# EasyEDA Pro project ProProject_2.4G Wireless_2024-12-04.epro, board PCB_2.4g 无线遥控板 copy
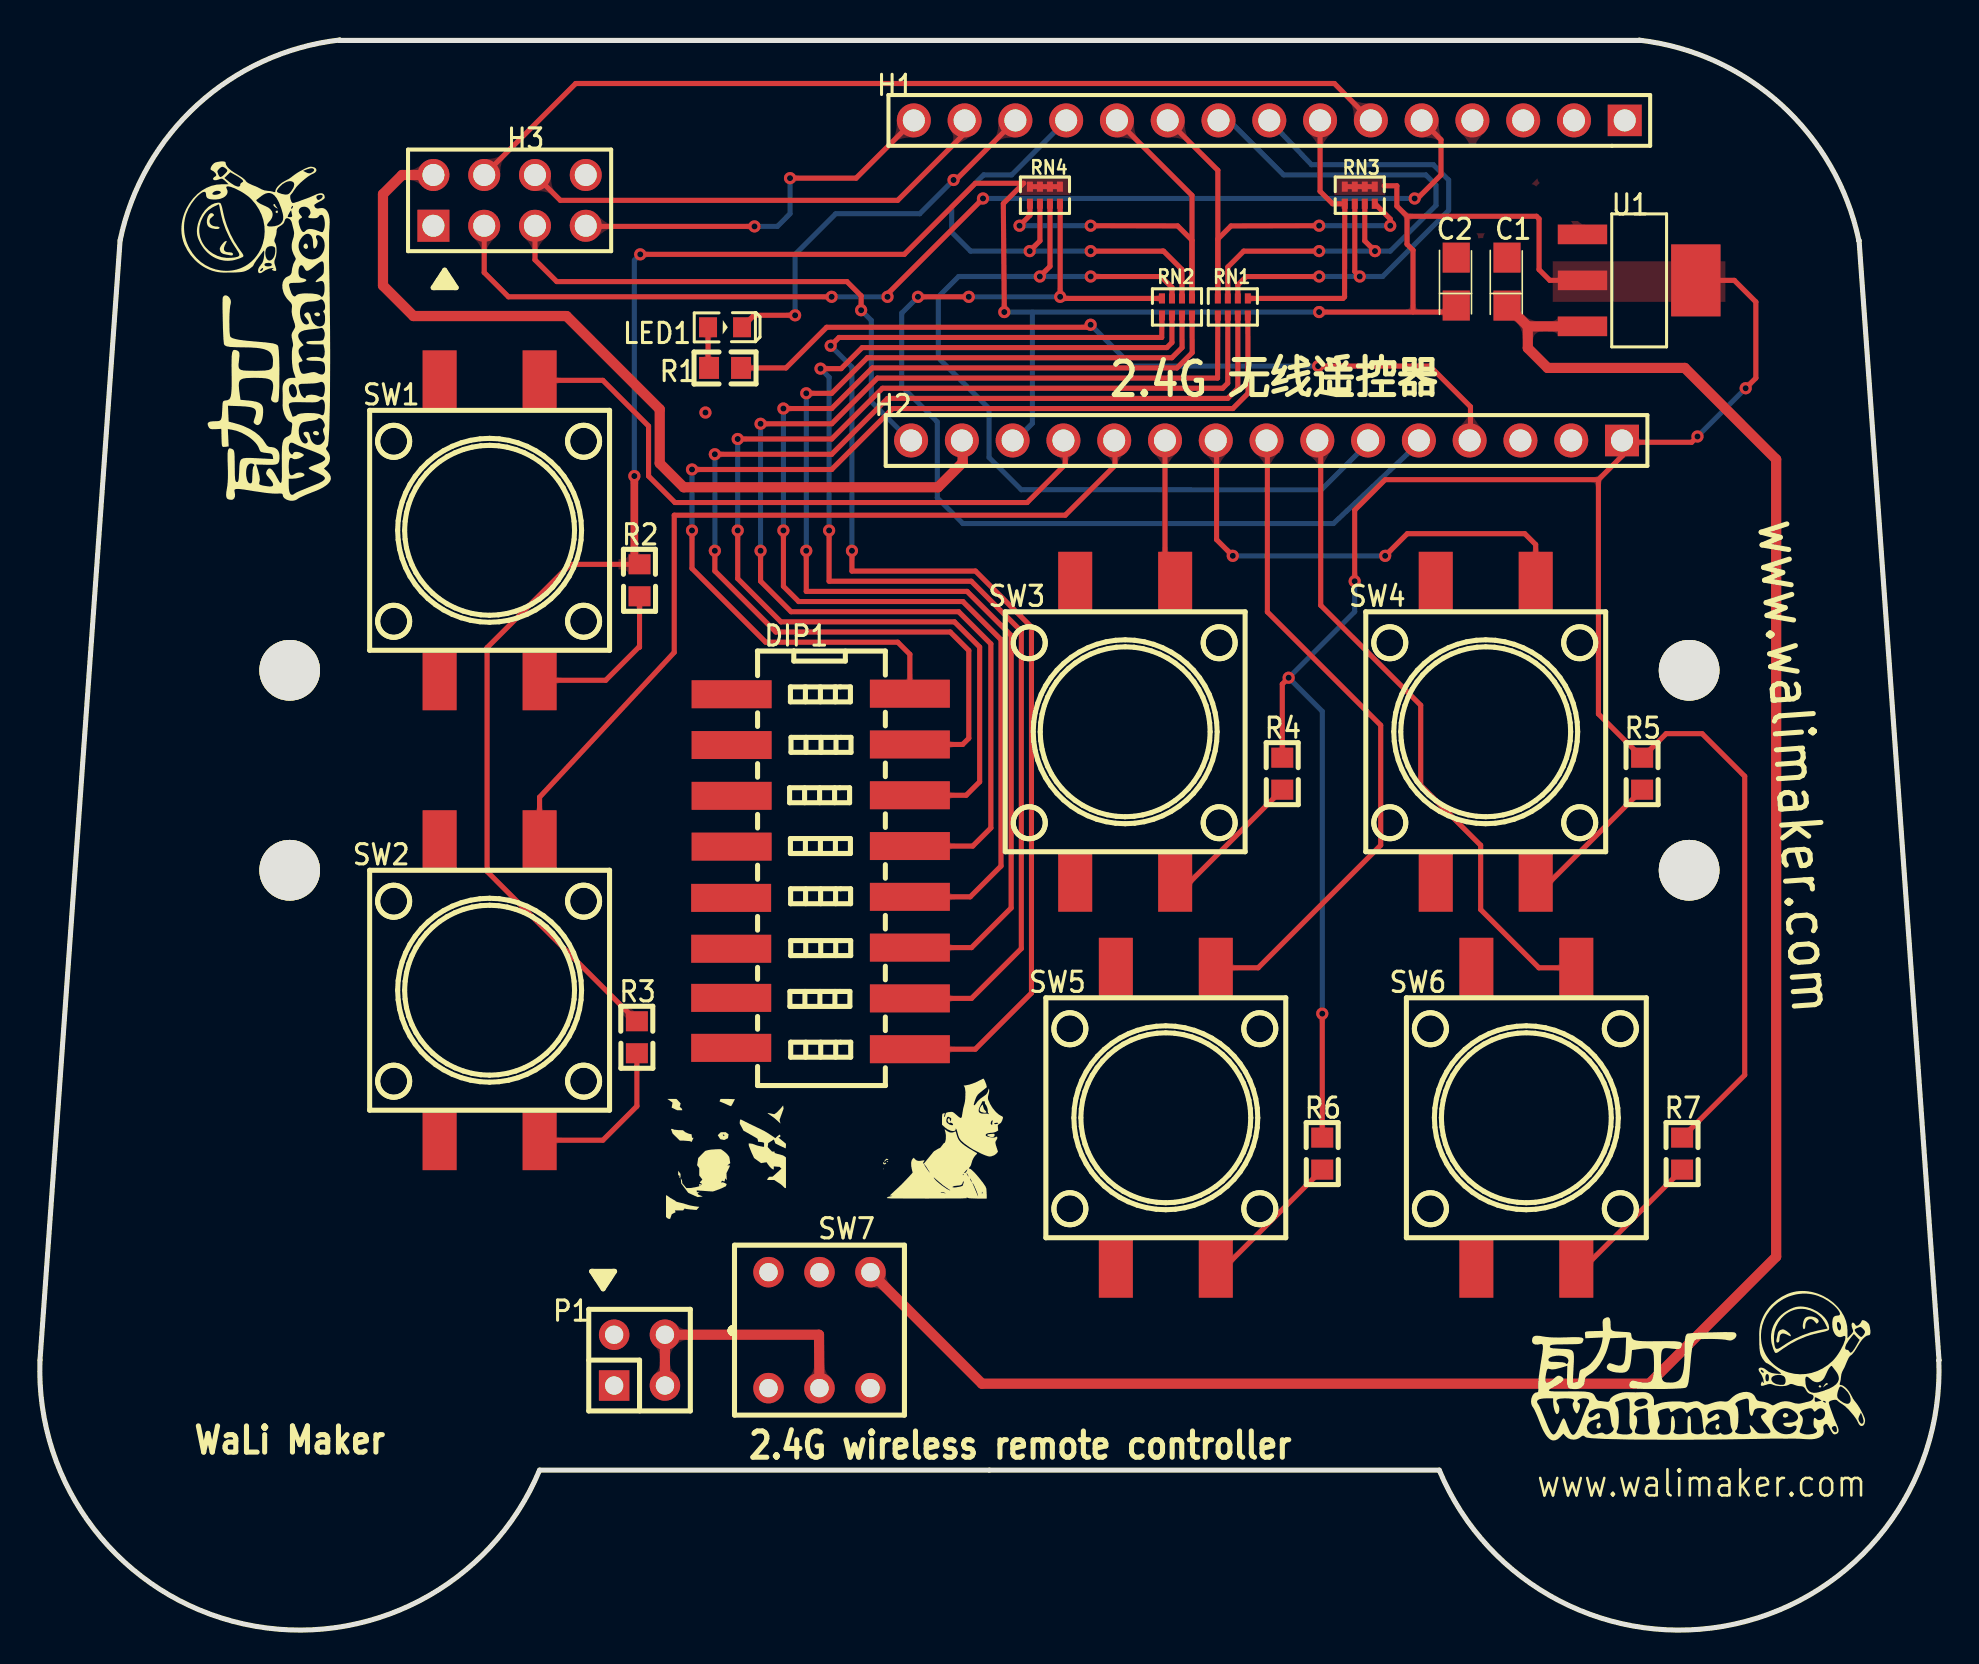
[diagram p8: board, top side]
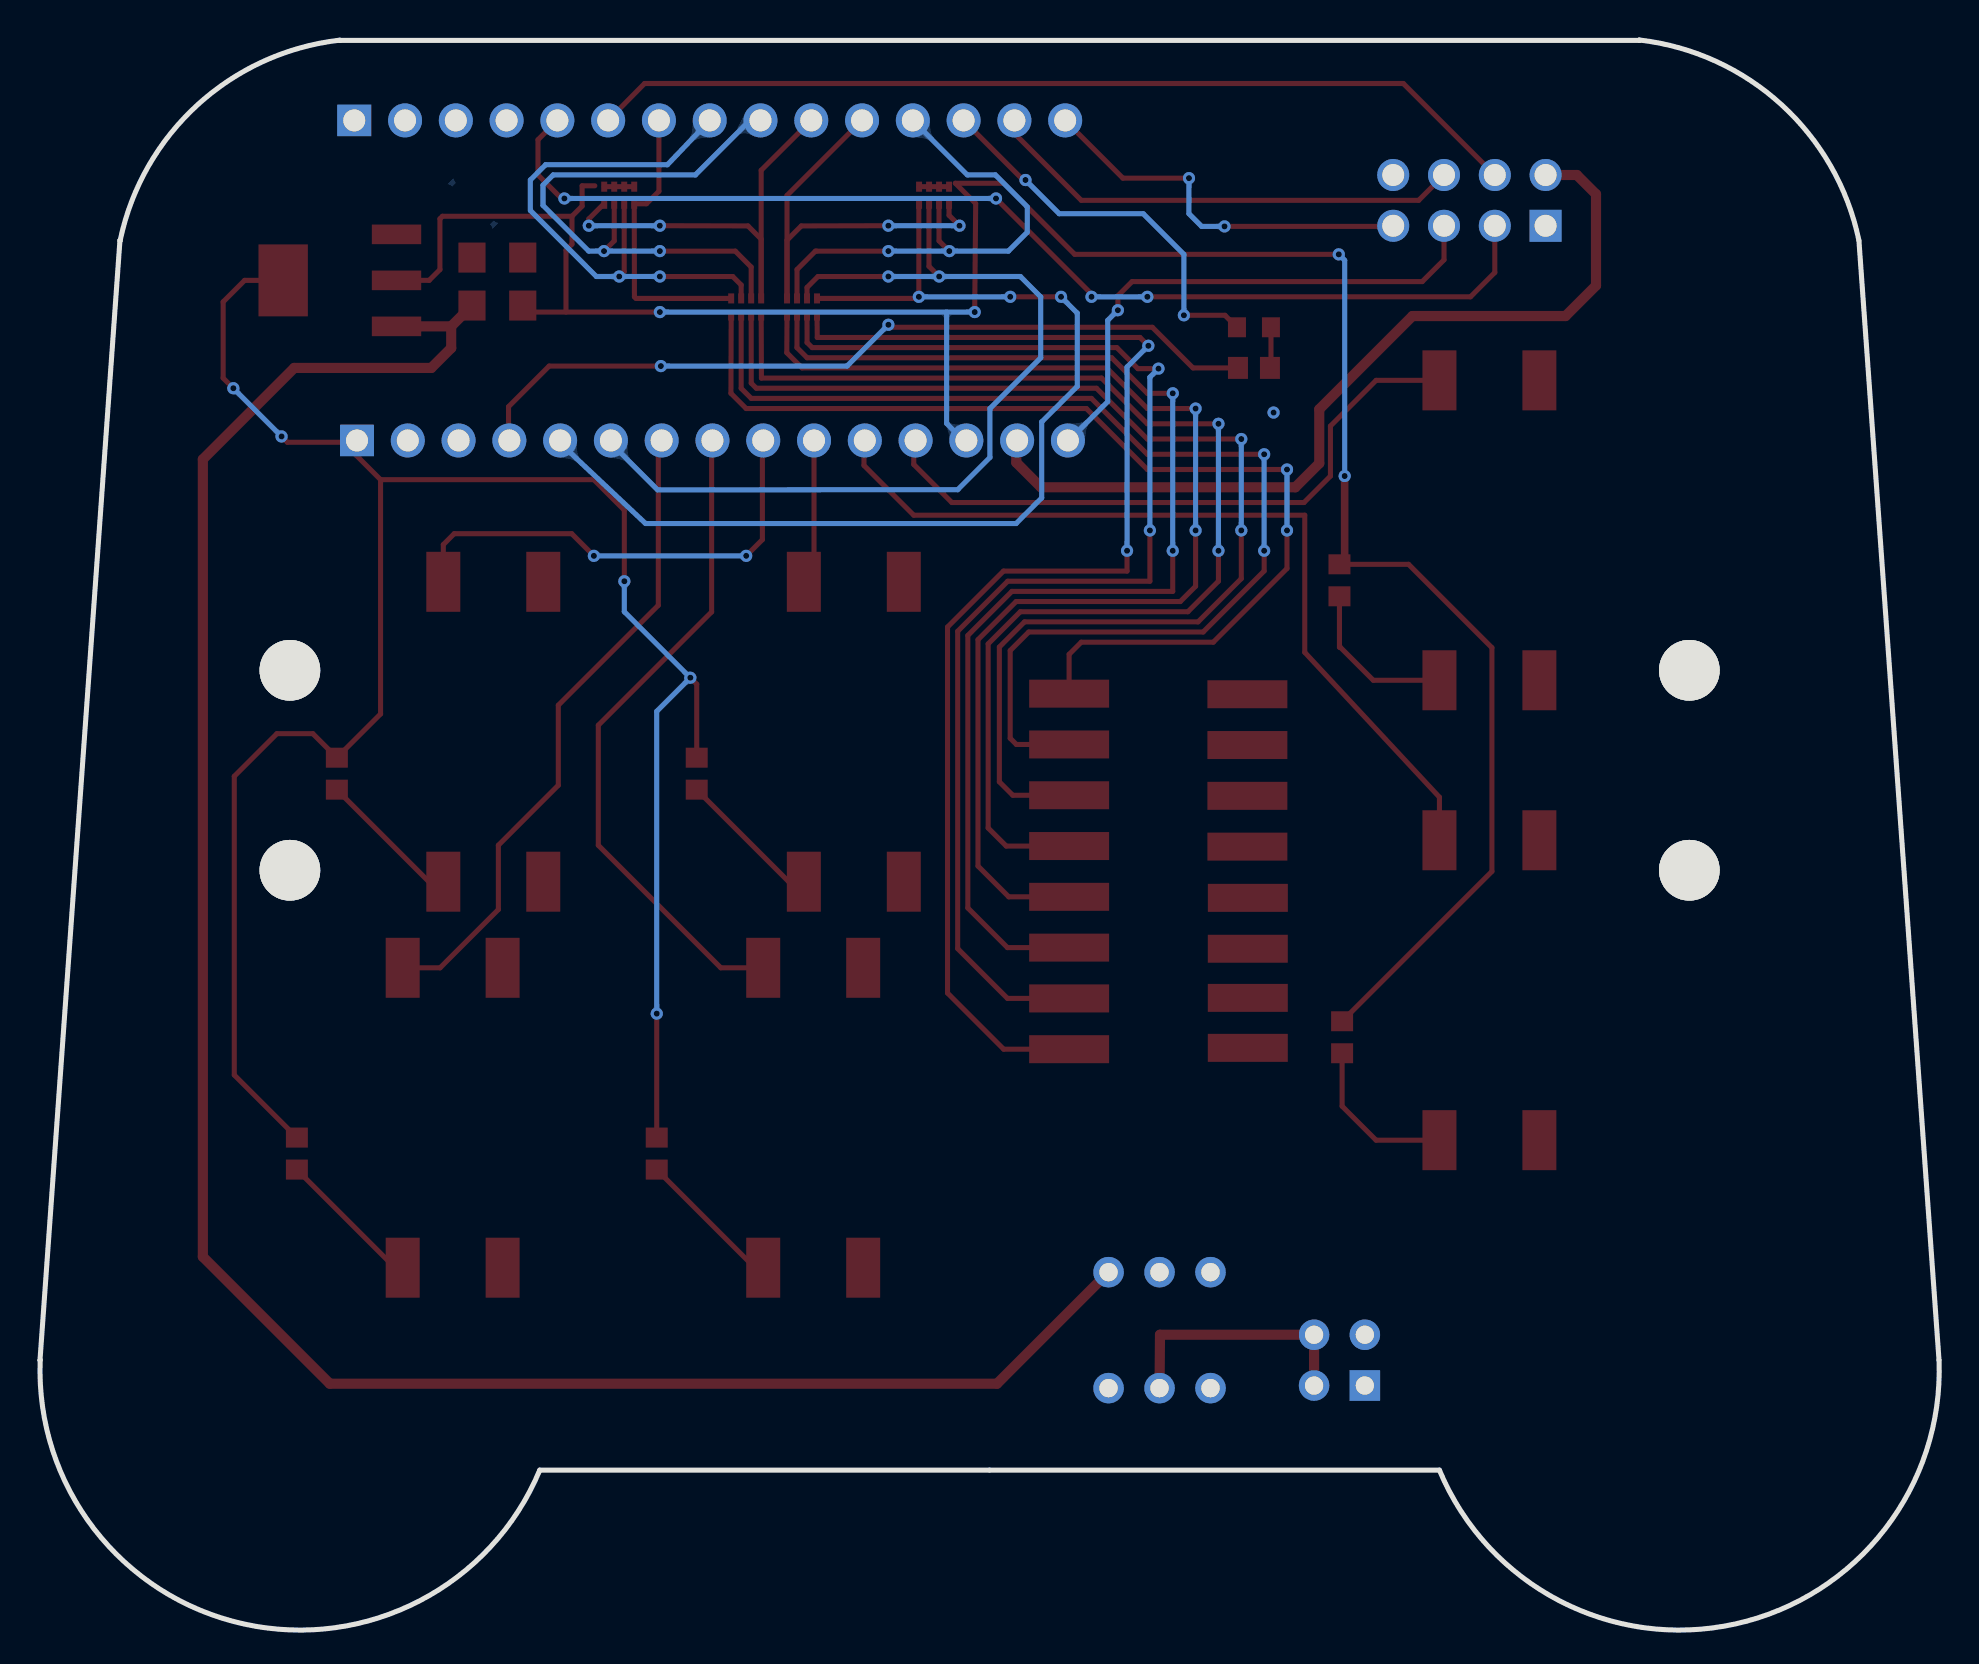
[diagram p9: board, bottom side, seen from below]

Outline 94.99 x 79.22 mm; copper layers: Top Layer, Bottom Layer. Coordinates in mm from the lower left corner of the outline.
Outline path: 0,13.2 4.01,69.19 arc(7.88,75.98) 14.99,79.22 14.99,79.2 79.99,79.2 80,79.21 arc(87.11,75.97) 90.98,69.18 90.99,69.2 94.99,13.2 94.98,13.2 arc(84.78,0) 69.99,7.7 24.99,7.7 arc(10.2,0) 0,13.2
Stack: Top Layer 0.035mm / Dielectric1 1.51mm FR4 er 4.5 / Bottom Layer 0.035mm

## Design rules (mm)
spacing Default (default): track to track 0.152, other pairs 0 to 0.152
track width Default (default): min 0.152, default 0.152, max 25.4
differential pair differentialPair (default): width min 0.127, default 0.254, max 2.54; gap min 0.152, default 0.152
via Default (default): diameter min 0.61, default 0.61, max 100.025; hole min 0.305, default 0.305, max 59.995
net GND uses gge1832
pour e631 uses gge1832

## Placement (name value [footprint] x y rotation side)
C1  10u  [CASE-A_3216]  73.38 67.14 90 top
C2  10u  [CASE-A_3216]  70.84 67.14 90 top
DIP1  HAD-08HWA-R  [SW-SMD_16P-L21.4-W6.4-P2.54-LS9.8]  39.04 37.64 270 top
H1  H(F)-2.54_1x15  [HDR-TH_15P-P2.54-V]  61.49 75.2 180 top
H2  H(F)-2.54_1x15  [HDR-TH_15P-P2.54-V]  61.35 59.19 180 top
H3  H(F)-2.54_2x4  [HDR-TH_8P-P2.54-V-R2-C4-S2.54]  23.49 71.2 0 top
LED1  LED-0603_B  [LED0603_BLUE]  34.27 64.85 0 top
NOREF  -  [Pad_ie940]  12.49 37.7 0 top
NOREF#2  -  [Pad_ie942]  82.49 37.7 0 top
NOREF#3  -  [Pad_ie943]  82.49 47.7 0 top
NOREF#4  -  [Pad_ie941]  12.49 47.7 0 top
P1  Header-Male-2.54_2x2  [HDR-TH_4P-P2.54-V-R2-C2-S2.54]  29.99 13.2 0 top
R1  220  [R0603]  34.27 62.82 180 top
R2  4.7k  [R0603]  29.99 52.2 90 top
R3  4.7k  [R0603]  29.86 29.34 90 top
R4  4.7k  [R0603]  62.14 42.53 90 top
R5  4.7k  [R0603]  80.14 42.53 90 top
R6  4.7k  [R0603]  64.14 23.53 90 top
R7  4.7k  [R0603]  82.14 23.53 90 top
RN1  220  [RES-ARRAY-SMD_0402-8P-L2.0-W1.0-BL]  59.67 65.87 180 top
RN2  220  [RES-ARRAY-SMD_0402-8P-L2.0-W1.0-BL]  56.87 65.87 0 top
RN3  4.7K  [RES-ARRAY-SMD_0402-8P-L2.0-W1.0-BL]  66.02 71.45 180 top
RN4  4.7K  [RES-ARRAY-SMD_0402-8P-L2.0-W1.0-BL]  50.27 71.45 180 top
SW1  K2-1103SP-J4SW-04  [KEY-SMD_4P-L12.0-W12.0-P5.00-LS15.00]  22.49 54.7 270 top
SW2  K2-1103SP-J4SW-04  [KEY-SMD_4P-L12.0-W12.0-P5.00-LS15.00]  22.49 31.7 270 top
SW3  K2-1103SP-J4SW-04  [KEY-SMD_4P-L12.0-W12.0-P5.00-LS15.00]  54.28 44.62 270 top
SW4  K2-1103SP-J4SW-04  [KEY-SMD_4P-L12.0-W12.0-P5.00-LS15.00]  72.32 44.62 270 top
SW5  K2-1103SP-J4SW-04  [KEY-SMD_4P-L12.0-W12.0-P5.00-LS15.00]  56.31 25.32 270 top
SW6  K2-1103SP-J4SW-04  [KEY-SMD_4P-L12.0-W12.0-P5.00-LS15.00]  74.35 25.32 270 top
SW7  K8-8585D-N1  [KEY-TH_6P-L8.5-W8.5-P2.54]  38.99 14.7 0 top
U1  LM1117MPX-5.0/NOPB  [SOT-223-4_L6.5-W3.5-P2.30-LS7.0-BR]  79.99 67.2 180 top

## Footprints (pads in the part's own frame, mm; a bottom-side part is the same pattern mirrored in y, then rotated)
CASE-A_3216
  rect 1.5x1.359 smd: 1(-1.2,0) 2(1.2,0)
HDR-TH_4P-P2.54-V-R2-C2-S2.54
  rect 1.524x1.524 hole 0.914: 1(-1.27,-1.27)
  round 1.524 hole 0.914: 2(-1.27,1.27) 3(1.27,-1.27) 4(1.27,1.27)
HDR-TH_8P-P2.54-V-R2-C4-S2.54
  rect 1.6x1.6 hole 1.1: 1(-3.81,-1.27)
  round 1.6 hole 1.1: 2(-3.81,1.27) 3(-1.27,-1.27) 4(-1.27,1.27) 5(1.27,-1.27) 6(1.27,1.27) 7(3.81,-1.27) 8(3.81,1.27)
HDR-TH_15P-P2.54-V
  rect 1.7x1.575 hole 1.1: 1(-17.78,0)
  round 1.7 hole 1.1: 2(-15.24,0) 3(-12.7,0) 4(-10.16,0) 5(-7.62,0) 6(-5.08,0) 7(-2.54,0) 8(0,0) 9(2.54,0) 10(5.08,0) 11(7.62,0) 12(10.16,0) 13(12.7,0) 14(15.24,0) 15(17.78,0)
KEY-SMD_4P-L12.0-W12.0-P5.00-LS15.00
  rect 3x1.7 smd: 1(-7.5,2.5) 2(7.499,2.5) 3(-7.5,-2.5) 4(7.499,-2.5)
KEY-TH_6P-L8.5-W8.5-P2.54
  round 1.524 hole 0.919x0.914: 1(-2.55,-2.9) 2(0,-2.9) 3(2.55,-2.9) 4(-2.55,2.9) 5(0,2.9) 6(2.55,2.9)
LED0603_BLUE
  rect 0.9x1 smd: 1(-0.85,0) 2(0.85,0)
Pad_ie940
  round 3.032 hole 3.037x3.032: (0,0)
Pad_ie941
  round 3.032 hole 3.037x3.032: (0,0)
Pad_ie942
  round 3.032 hole 3.037x3.032: (0,0)
Pad_ie943
  round 3.032 hole 3.037x3.032: (0,0)
R0603
  rect 1x1.1 smd: 1(-0.8,0) 2(0.8,0)
RES-ARRAY-SMD_0402-8P-L2.0-W1.0-BL
  rect 0.3x0.505 smd: 1(-0.75,0.427) 2(-0.25,0.427) 3(0.25,0.427) 4(0.75,0.427) 5(0.75,-0.427) 6(0.25,-0.427) 7(-0.25,-0.427) 8(-0.75,-0.427)
SOT-223-4_L6.5-W3.5-P2.30-LS7.0-BR
  rect 2.47x0.98 smd: 1(2.835,-2.3) 2(2.835,0) 3(2.835,2.3)
  rect 2.47x3.6 smd: 4(-2.835,0)
SW-SMD_16P-L21.4-W6.4-P2.54-LS9.8
  rect 1.4x4 smd: 1(-8.861,-4.447) 2(-6.321,-4.447) 3(-3.781,-4.447) 4(-1.241,-4.447) 5(1.322,-4.47) 6(3.866,-4.467) 7(6.324,-4.467) 8(8.823,-4.467) 9(8.89,4.47) 10(6.35,4.47) 11(3.81,4.47) 12(1.27,4.47) 13(-1.27,4.47) 14(-3.81,4.47) 15(-6.35,4.47) 16(-8.89,4.47)

## Nets
+5V: C2.1 H2.1 H2.13 R2.2 R3.2 R4.2 R5.2 R6.2 R7.2 RN3.5 RN3.6 RN3.7 RN3.8 RN4.5 RN4.6 RN4.7 RN4.8 U1.2 U1.4
GND: C1.2 C2.2 DIP1.1 DIP1.2 DIP1.3 DIP1.4 DIP1.5 DIP1.6 DIP1.7 DIP1.8 H1.4 H2.2 H3.1 P1.1 P1.2 SW1.3 SW2.3 SW3.3 SW4.3 SW5.3 SW6.3 U1.1
VCC: P1.3 P1.4 SW7.2
DIP1_9: DIP1.9 RN2.8
DIP1_10: DIP1.10 RN2.7
DIP1_11: DIP1.11 RN2.6
DIP1_12: DIP1.12 RN2.5
DIP1_13: DIP1.13 RN1.4
DIP1_14: DIP1.14 RN1.3
DIP1_15: DIP1.15 RN1.2
DIP1_16: DIP1.16 RN1.1
H1_1: H1.1
H1_2: H1.2
H1_3: H1.3
H1_5: H1.5 H3.3
H1_6: H1.6 H3.4
H1_13: H1.13 LED1.2
H1_14: H1.14 H3.6
H1_15: H1.15 H3.7
H2_3: H2.3
H2_4: H2.4 R1.1
H2_7: H2.7 SW6.1
H2_8: H2.8 SW5.1
H2_9: H2.9 SW4.1
H2_10: H2.10 SW3.1
H2_11: H2.11 SW2.1
H2_12: H2.12 SW1.1
H2_14: H2.14 H3.2
H2_15: H2.15 H3.5
H3_8: H3.8
LED1_1: LED1.1 R1.2
NETLABEL1: H2.5 RN2.1 RN4.1
NETLABEL2: H2.6 RN2.2 RN4.2
NETLABEL3: H1.12 RN2.3 RN4.3
NETLABEL4: H1.11 RN2.4 RN4.4
NETLABEL5: H1.10 RN1.5 RN3.1
NETLABEL6: H1.9 RN1.6 RN3.2
NETLABEL7: H1.8 RN1.7 RN3.3
NETLABEL8: H1.7 RN1.8 RN3.4
R3_1: R3.1 SW2.2
R4_1: R4.1 SW3.2
R5_1: R5.1 SW4.2
R7_1: R7.1 SW6.2
SW1_2: R2.1 SW1.2
SW1_4: SW1.4
SW2_4: SW2.4
SW3_4: SW3.4
SW4_4: SW4.4
SW5_2: R6.1 SW5.2
SW5_4: SW5.4
SW6_4: SW6.4
SW7_1: SW7.1
SW7_3: SW7.3
SW7_4: SW7.4
SW7_5: SW7.5
SW7_6: C1.1 SW7.6 U1.3

## Via types
v1: diameter 0.61, hole 0.305, Top Layer to Bottom Layer, 54 vias

## Routing (per net, layer and track width the routed paths; a pad name or vN(x,y) marks a point on that pad's centre or on a via; arc(x,y) is an arc through that point)
+5V: length 233.9
  Top Layer w0.254: 29.73,53 26.53,53 22.36,48.83 22.36,37.64 R3.2 ; R7.2 85.27,27.46 85.27,42.39 83.14,44.53 81.34,44.53 R5.2 77.95,45.51 77.95,57.23 ; v1(82.91,59.39) 82.62,59.1 79.17,59.1 79.17,58.45 77.95,57.23 ; 48.24,65.61 48.19,71.04 49.2,72.05 46.79,72.05 43.23,68.5 v1(30.03,68.5) ; 68.38,70.4 68.38,69.01 68.68,68.71 68.68,65.61 ; 68.38,70.4 67.87,70.91 67.87,71.93 67.24,71.93 ; 68.38,70.4 74.86,70.4 74.98,70.28 74.98,67.74 75.52,67.2 U1.2 ; RN3.5 RN3.8 ; R6.2 v1(64.14,30.53) ; v1(65.76,52.15) 65.76,55.71 67.29,57.23 77.95,57.23 ; RN4.5 RN4.8 ; v1(85.32,61.8) 85.83,62.31 85.83,66.12 84.75,67.2 U1.4 ; v1(62.46,47.32) 62.14,47 R4.2 ; v1(63.98,65.61) 70.52,65.61 C2.1
  Top Layer w0.381: 29.73,53 v1(29.73,57.41)
  Bottom Layer w0.254: 49.64,65.61 49.64,60.05 48.69,59.1 ; v1(65.76,52.15) 65.76,50.63 v1(62.46,47.32) 64.14,45.64 v1(64.14,30.53) ; v1(48.24,65.61) v1(63.98,65.61) ; 29.73,57.74 29.73,68.2 v1(30.03,68.5) ; v1(82.91,59.39) v1(85.32,61.8)
GND:
  vias: v1(33.29,60.59)
VCC: length 12.9
  Top Layer w0.508: P1.3 P1.4 ; 31.26,14.47 38.97,14.47 38.99,11.8
DIP1_9: length 65.2
  Top Layer w0.254: v1(39.55,63.93) 39.97,64.34 56.11,64.34 RN2.8 ; v1(40.62,53.67) 40.62,52.66 46.79,52.66 49.59,49.86 49.59,31.56 46.79,28.75 DIP1.9
  Bottom Layer w0.254: v1(39.55,63.93) 40.62,62.86 v1(40.62,53.67)
DIP1_10: length 63.4
  Top Layer w0.254: RN2.7 56.62,64.09 56.36,63.83 41.13,63.83 40.07,62.78 v1(39.04,62.78) ; DIP1.10 46.59,31.29 49.09,33.78 49.09,49.65 46.58,52.15 39.47,52.15 39.47,54.69
  Bottom Layer w0.254: v1(39.04,62.78) 39.47,62.35 39.47,54.69
  vias: v1(39.47,54.69)
DIP1_11: length 61.9
  Top Layer w0.254: DIP1.11 46.59,33.83 48.58,35.81 48.58,49.44 46.37,51.64 38.33,51.64 v1(38.33,53.67) ; RN2.6 57.13,63.83 56.62,63.33 41.38,63.33 39.6,61.55 v1(38.33,61.55)
  Bottom Layer w0.254: v1(38.33,53.67) v1(38.33,61.55)
DIP1_12: length 60.9
  Top Layer w0.254: DIP1.12 46.53,36.37 48.07,37.91 48.07,49.23 46.16,51.13 37.95,51.13 37.19,51.9 v1(37.19,54.69) ; RN2.5 57.63,63.58 56.87,62.82 41.63,62.82 39.6,60.79 v1(37.19,60.79)
  Bottom Layer w0.254: v1(37.19,54.69) v1(37.19,60.79)
DIP1_13: length 61.3
  Top Layer w0.254: 58.92,65.44 58.9,62.31 41.89,62.31 39.6,60.02 v1(36.04,60.02) ; DIP1.13 46.66,38.91 47.56,39.81 47.56,49.02 45.95,50.63 37.57,50.63 36.04,52.15 v1(36.04,53.67)
  Bottom Layer w0.254: v1(36.04,53.67) v1(36.04,60.02)
DIP1_14: length 60.1
  Top Layer w0.254: DIP1.14 46.33,41.45 47,42.12 47,48.86 45.74,50.12 37.06,50.12 34.9,52.28 34.9,54.69 ; RN1.3 59.41,62.06 59.16,61.8 42.14,61.8 39.6,59.26 34.9,59.26
  Bottom Layer w0.254: 34.9,54.69 34.9,59.26
  vias: v1(34.9,59.26) v1(34.9,54.69)
DIP1_15: length 58.8
  Top Layer w0.254: v1(33.76,58.5) 39.6,58.5 42.4,61.29 59.41,61.29 59.92,61.8 RN1.2 ; v1(33.76,53.67) 33.76,52.66 36.81,49.61 45.53,49.61 46.46,48.68 46.46,44.3 46.15,43.99 DIP1.15
  Bottom Layer w0.254: v1(33.76,53.67) v1(33.76,58.5)
DIP1_16: length 52.9
  Top Layer w0.254: RN1.1 60.43,61.55 59.67,60.79 42.65,60.79 39.6,57.74 v1(32.61,57.74) ; v1(32.61,54.69) 32.61,52.79 36.3,49.1 42.9,49.1 43.51,48.49 DIP1.16
  Bottom Layer w0.254: v1(32.61,54.69) v1(32.61,57.74)
H1_5: length 56.4
  Top Layer w0.254: v1(47.17,71.29) 42.39,66.51 v1(42.39,66.37) ; H1.5 70.08,74.23 70.08,72.47 68.9,71.29 v1(68.76,71.29) ; H3.3 22.22,67.59 23.43,66.37 v1(39.6,66.37)
  Bottom Layer w0.254: v1(39.6,66.37) v1(42.39,66.37) ; v1(47.17,71.29) v1(68.76,71.29)
H1_6: length 47
  Top Layer w0.254: 22.22,72.47 26.8,77.04 64.75,77.04 66.57,75.2
H1_13: length 19.7
  Top Layer w0.254: v1(37.77,65.45) 35.72,65.45 LED1.2 ; H1.13 45.81,72.22 v1(45.7,72.22)
  Bottom Layer w0.254: v1(37.77,65.45) 37.77,68.5 39.8,70.53 44.01,70.53 v1(45.7,72.22)
H1_14: length 24.1
  Top Layer w0.254: 24.76,72.47 26.03,71.2 42.9,71.2 46.25,74.55 46.25,75.2
H1_15: length 19.7
  Top Layer w0.254: 35.74,69.89 27.33,69.89 27.3,69.92 ; H1.15 40.82,72.31 v1(37.52,72.31)
  Bottom Layer w0.254: v1(35.74,69.89) 36.88,69.89 37.52,70.53 v1(37.52,72.31)
H2_4: length 40.9
  Top Layer w0.254: 35.07,62.82 37.32,62.82 39.35,64.85 52.43,64.85 v1(52.55,64.98) ; v1(63.93,62.91) 69.52,62.91 71.55,60.88 71.55,59.1
  Bottom Layer w0.254: v1(52.55,64.98) 54.62,62.91 v1(63.93,62.91)
H2_7: length 32.7
  Top Layer w0.254: 63.93,59.1 64.06,58.97 64.06,50.95 69.06,45.95 69.06,41.95 72.06,38.95 72.06,35.73 74.98,32.82 76.85,32.82
H2_8: length 33.3
  Top Layer w0.254: 61.39,59.1 61.39,50.61 67.06,44.95 67.06,38.95 60.93,32.82 58.81,32.82
H2_9: length 23.7
  Top Layer w0.254: v1(59.67,53.42) 58.85,54.23 58.85,59.1 ; SW4.1 74.82,53.98 74.27,54.53 68.39,54.53 v1(67.29,53.42)
  Bottom Layer w0.254: v1(59.67,53.42) v1(67.29,53.42)
H2_10: length 7.3
  Top Layer w0.254: H2.10 56.27,52.63 56.78,52.12
H2_11: length 43.1
  Top Layer w0.254: 24.99,39.2 24.99,41.35 31.73,48.59 31.73,55.45 51.28,55.45 53.77,57.94 53.77,59.1
H2_12: length 32.2
  Top Layer w0.254: 51.23,59.1 51.28,59.05 51.28,57.99 49.38,56.09 31.76,56.09 30.44,57.41 30.44,59.91 28.16,62.2 SW1.1
H2_14: length 43.8
  Top Layer w0.508: H3.2 18.11,72.47 17.16,71.51 17.16,66.94 18.68,65.41 26.34,65.41 31,60.75 31,58.05 32.2,56.85 44.92,56.85 46.15,58.08 46.15,59.1
H2_15: length 27.1
  Top Layer w0.254: v1(41.07,65.7) 41.07,66.42 40.36,67.14 25.85,67.14 24.76,68.22 24.76,69.93
  Bottom Layer w0.254: 43.61,59.1 41.58,61.13 41.58,65.2 v1(41.07,65.7)
LED1_1: length 2.1
  Top Layer w0.254: R1.2 33.42,62.87 LED1.1
NETLABEL1: length 54.3
  Top Layer w0.254: v1(43.92,66.37) v1(46.46,66.37) ; 56.12,66.29 51.11,66.29 v1(51.03,66.37) 51.03,71.03
  Bottom Layer w0.254: v1(43.92,66.37) 43.11,65.56 43.11,61.89 44.88,60.12 44.88,56.32 46.16,55.04 64.7,55.04 69.01,59.1 ; v1(46.46,66.37) v1(51.03,66.37)
NETLABEL2: length 46.5
  Top Layer w0.254: v1(52.56,67.39) 55.89,67.39 56.08,67.39 56.62,66.84 56.62,66.29 ; v1(50.01,67.39) 50.52,67.9 50.52,71.03
  Bottom Layer w0.254: 66.47,59.1 64.1,56.72 49.09,56.73 47.47,58.34 47.47,60.79 44.93,63.33 44.93,66.37 45.95,67.39 v1(52.55,67.39)
NETLABEL3: length 25.1
  Top Layer w0.254: v1(49.51,68.66) 50.02,69.17 RN4.3 50.01,71.02 ; 57.12,66.29 57.12,67.74 56.2,68.66 56.15,68.66 v1(52.56,68.66)
  Bottom Layer w0.254: H1.12 48.6,72.47 47.2,72.47 45.6,70.87 45.6,69.6 46.55,68.66 v1(52.55,68.66)
NETLABEL4: length 23.6
  Top Layer w0.254: v1(52.56,69.93) 56.91,69.92 57.62,69.2 RN2.4 ; RN4.4 49.52,70.45 v1(49,69.93) ; 53.87,75.2 57.62,71.44 57.62,66.29
  Bottom Layer w0.254: v1(49,69.93) v1(52.55,69.93)
NETLABEL5: length 23.2
  Top Layer w0.254: RN1.5 58.92,69.26 59.57,69.92 v1(63.98,69.93) ; 58.92,66.29 58.92,72.7 56.41,75.2 ; 66.78,71.03 67.54,70.27 v1(67.54,69.93)
  Bottom Layer w0.254: v1(63.99,69.93) v1(67.54,69.93)
NETLABEL6: length 29.1
  Top Layer w0.254: v1(66.78,68.66) 66.27,69.17 RN3.2 ; RN1.6 59.42,67.86 60.21,68.66 v1(63.98,68.66)
  Bottom Layer w0.254: 58.95,75.2 59.48,75.2 62.21,72.47 69.32,72.47 69.83,71.96 69.83,70.95 67.54,68.66 v1(66.78,68.66) v1(63.98,68.66)
NETLABEL7: length 28.3
  Top Layer w0.254: v1(66.02,67.39) 65.77,67.64 RN3.3 ; 63.99,67.39 60.34,67.39 59.92,66.97 RN1.7
  Bottom Layer w0.254: H1.8 63.6,72.98 69.7,72.98 70.46,72.22 70.46,70.69 67.16,67.39 v1(66.02,67.39) v1(63.98,67.39)
NETLABEL8: length 14.6
  Top Layer w0.254: 64.03,75.19 64.03,71.65 64.66,71.03 RN3.4 65.26,66.37 65.17,66.29 60.42,66.29
R3_1: length 8.2
  Top Layer w0.254: 24.99,24.2 28.16,24.2 29.86,25.9 R3.1
R4_1: length 7.3
  Top Layer w0.254: 56.78,37.12 57.54,37.12 R4.1
R5_1: length 7.2
  Top Layer w0.254: R5.1 75.54,37.12 SW4.2
R7_1: length 7.3
  Top Layer w0.254: SW6.2 77.23,17.82 R7.1
SW1_2: length 8.2
  Top Layer w0.254: 24.99,47.2 28.3,47.2 29.95,48.85 29.99,48.85 R2.1
SW5_2: length 7.4
  Top Layer w0.254: R6.1 59.23,17.82 58.81,17.82
SW7_6: length 110.1
  Top Layer w0.508: C1.1 74.42,64.9 ; 74.42,64.9 74.42,63.81 75.41,62.82 82.27,62.82 86.84,58.25 86.84,18.37 80.49,12.02 47.12,12.02 41.54,17.6 ; 74.42,64.9 U1.3

## Copper pours and planes (outline as drawn; the poured copper is in the pictures)
+5V on Top Layer: 64.75,72.47 67.29,72.47 67.29,71.45 64.75,71.45
+5V on Top Layer: 29.08,30.85 30.21,30.85 30.21,29.82 29.08,29.82
+5V on Top Layer: 49,72.47 51.54,72.47 51.54,71.45 49,71.45
+5V on Top Layer: 75.67,68.15 84.3,68.15 84.3,66.12 75.67,66.12
GND on Top Layer: 97.39,83.83 97.39,-1.17 -2.61,-1.17 -2.61,83.83
GND on Bottom Layer: 102.39,88.83 -7.61,88.83 -7.61,-6.17 102.39,-6.17
H1_5 on Top Layer: 69.12,75.19 70.16,75.19 70.16,74.15 69.12,74.15
H1_6 on Top Layer: 65.53,76.25 66.57,76.25 66.57,75.21 65.53,75.21
H1_13 on Top Layer: 47.75,75.19 48.78,75.19 48.78,74.15 47.75,74.15
H1_15 on Top Layer: 42.67,75.19 43.7,75.19 43.7,74.15 42.67,74.15
H2_7 on Top Layer: 63.43,58.71 64.6,58.71 64.6,57.83 63.43,57.83
H2_15 on Bottom Layer: 42.51,60.21 43.53,60.21 43.53,59.16 42.51,59.16
NETLABEL1 on Bottom Layer: 67.96,59.11 69.03,59.11 69.03,58.12 67.96,58.12
NETLABEL2 on Bottom Layer: 65.45,59.09 66.52,59.09 66.52,58.09 65.45,58.09
NETLABEL3 on Bottom Layer: 50.29,75.19 51.32,75.19 51.32,74.15 50.29,74.15
NETLABEL4 on Top Layer: 53.88,75.19 54.91,75.19 54.91,74.15 53.88,74.15
NETLABEL5 on Top Layer: 56.42,75.19 57.46,75.19 57.46,74.15 56.42,74.15
NETLABEL7 on Bottom Layer: 61.48,75.17 62.51,75.17 62.51,74.13 61.48,74.13
SW7_6 on Top Layer: 73.41,65.98 74.42,65.98 74.42,64.83 73.41,64.83
SW7_6 on Top Layer: 41.55,17.59 42.55,17.59 42.55,16.59 41.55,16.59
SW7_6 on Top Layer: 73.81,65.51 75.18,65.51 75.18,64.13 73.81,64.13

Small or netless copper shapes (teardrops, artwork), in the pictures only: 159 on Top Layer, 62 on Bottom Layer

## Text on the board
Top Silkscreen Layer: www.walimaker.com | WaLi Maker | 2.4G wireless remote controller | ▶ | 2.4G 无线遥控器
